# EAGLE design WaterMonitorV2.1 (EAGLE 7.4.0)
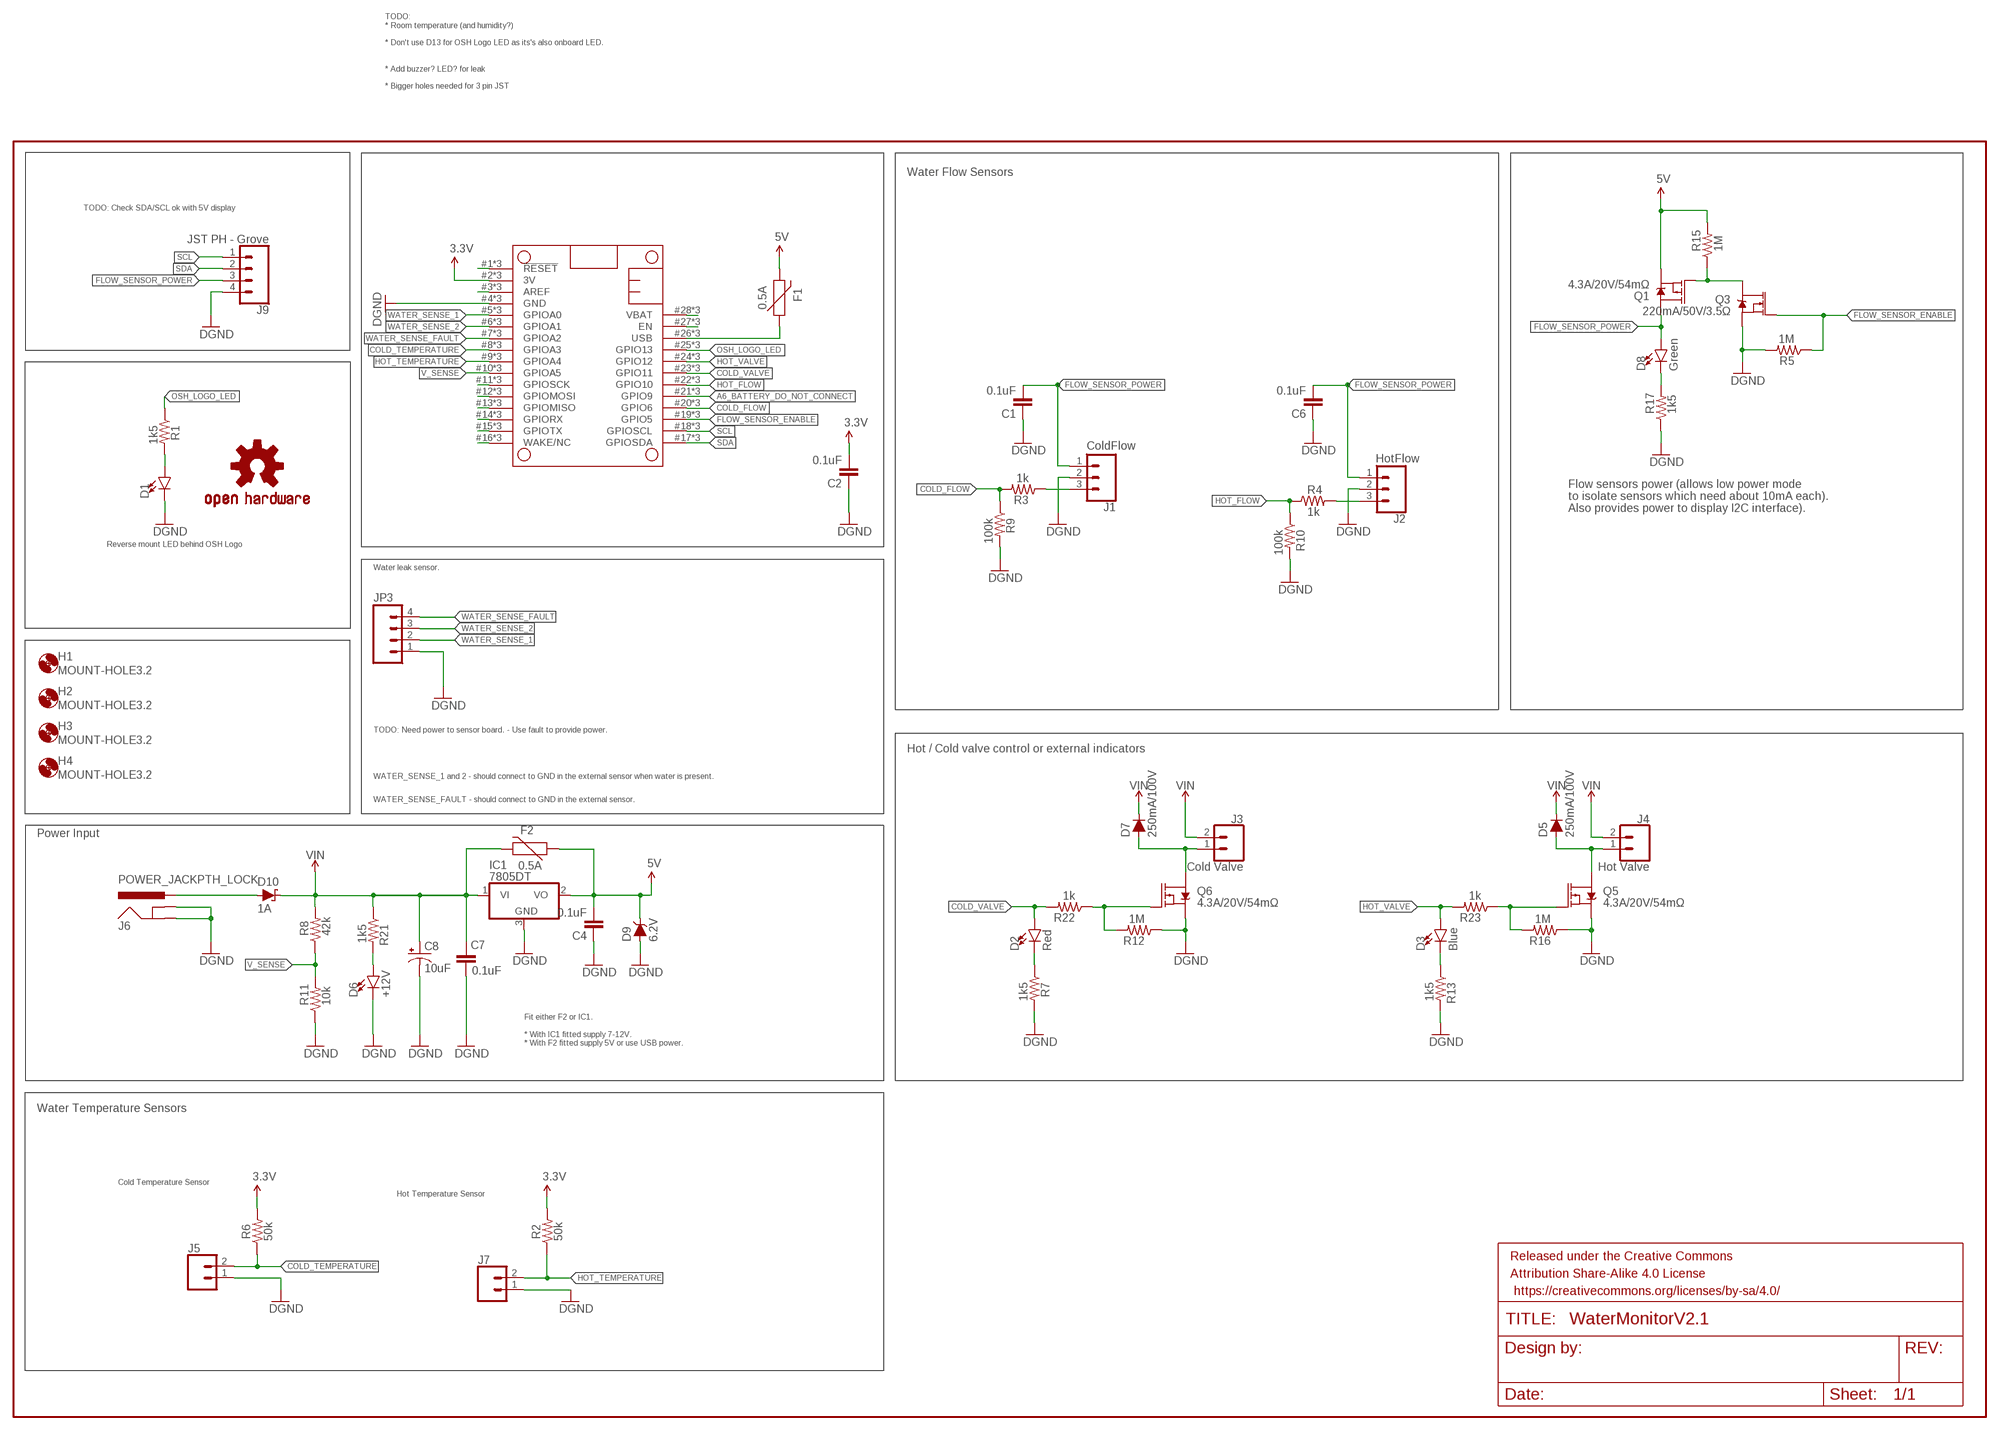
[diagram p0: schematic, sheet 1]

## Parts
C1  0.1uF  CAP0805  [0805]
C2  0.1uF  CAP0805  [0805]
C4  0.1uF  CAP0805  [0805]
C6  0.1uF  CAP0805  [0805]
C7  0.1uF  CAP0805  [0805]
C8  10uF  10UF-POLAR-EIA3216-16V-10%(TANT)  [EIA3216]
D1  LED1206-BOTTOM  [LED-1206-BOTTOM]
D2  Red  LED-BLUE1206  [LED-1206]
D3  Blue  LED-BLUE1206  [LED-1206]
D5  250mA/100V  DIODE-BAS16J  [SOD-323]
D6  +12V  LED-BLUE1206  [LED-1206]
D7  250mA/100V  DIODE-BAS16J  [SOD-323]
D8  Green  LED-BLUE1206  [LED-1206]
D9  6.2V  DIODE-ZENER-BZT52C3V6S  [SOD-323]
D10  1A  DIODE-SCHOTTKY-B340A  [SMA-DIODE]
F1  0.5A  PPTC_HALF-AMP  [1206]
F2  0.5A  PPTC_HALF-AMP  [1206]
FRAME2  FRAME-LEDGER  [CREATIVE_COMMONS]
H1  MOUNT-HOLE3.2  [3,2]
H2  MOUNT-HOLE3.2  [3,2]
H3  MOUNT-HOLE3.2  [3,2]
H4  MOUNT-HOLE3.2  [3,2]
IC1  7805DT  [TO252]
J1  ColdFlow  CONN_03JST-HX-PTH-VERT  [JST-HX-3-PTH-VERT]
J2  HotFlow  CONN_03JST-HX-PTH-VERT  [JST-HX-3-PTH-VERT]
J3  Cold Valve  CONN_025MM  [SCREWTERMINAL-5MM-2]
J4  Hot Valve  CONN_025MM  [SCREWTERMINAL-5MM-2]
J5  CONN_02POLAR  [MOLEX-1X2]
J6  POWER_JACKPTH_LOCK  [POWER_JACK_PTH_LOCK]
J7  CONN_02POLAR  [MOLEX-1X2]
J9  JST PH - Grove  CONN_04JST-PTH-VERT  [JST-4-PTH-VERT]
JP3  M04POLAR  [MOLEX-1X4@1]
LOGO1  OSHW-LOGOM  [OSHW-LOGO-M]
MS1  FEATHERWINGFEATHEWING_BREAKOUT  [FEATHERWING_BREAKOUT]
Q1  4.3A/20V/54mΩ  MOSFET_PCH-IRLML2244  [SOT23-3]
Q3  220mA/50V/3.5Ω  MOSFET-NCH-BSS138  [SOT23-3]
Q5  4.3A/20V/54mΩ  MOSFET_PCH-IRLML2244  [SOT23-3]
Q6  4.3A/20V/54mΩ  MOSFET_PCH-IRLML2244  [SOT23-3]
R1  1k5  RESISTOR0805  [0805]
R2  50k  RESISTOR0805  [0805]
R3  1k  RESISTOR0805  [0805]
R4  1k  RESISTOR0805  [0805]
R5  1M  RESISTOR0805  [0805]
R6  50k  RESISTOR0805  [0805]
R7  1k5  RESISTOR0805  [0805]
R8  42k  RESISTOR0805  [0805]
R9  100k  RESISTOR0805  [0805]
R10  100k  RESISTOR0805  [0805]
R11  10k  RESISTOR0805  [0805]
R12  1M  RESISTOR0805  [0805]
R13  1k5  RESISTOR0805  [0805]
R15  1M  RESISTOR0805  [0805]
R16  1M  RESISTOR0805  [0805]
R17  1k5  RESISTOR0805  [0805]
R21  1k5  RESISTOR0805  [0805]
R22  1k  RESISTOR0805  [0805]
R23  1k  RESISTOR0805  [0805]

## Nets
3.3V: C2.2 MS1.2(3V) MS1.#2(3V) MS1.@2(3V) R2.2 R6.2
5V: C4.2 D9.C F1.2 F2.1 IC1.2(VO) Q1.2(S) R15.2
A6_BATTERY_DO_NOT_CONNECT: MS1.21(GPIO9) MS1.#21(GPIO9) MS1.@21(GPIO9)
COLD_FLOW: MS1.20(GPIO6) MS1.#20(GPIO6) MS1.@20(GPIO6) R3.2 R9.1
COLD_TEMPERATURE: J5.2 MS1.8(GPIOA3) MS1.#8(GPIOA3) MS1.@8(GPIOA3) R6.1
COLD_VALVE: D2.A MS1.23(GPIO11) MS1.#23(GPIO11) MS1.@23(GPIO11) R22.2
FLOW_SENSOR_ENABLE: MS1.19(GPIO5) MS1.#19(GPIO5) MS1.@19(GPIO5) Q3.1(G) R5.1
FLOW_SENSOR_POWER: C1.2 C6.2 D8.A J1.1 J2.1 J9.3 Q1.3(D)
GND: C1.1 C2.1 C4.1 C6.1 C7.1 C8.- D1.C D6.C D9.A IC1.3(GND) J1.2 J2.2 J5.1 J6.GND J6.GNDBREAK J7.1 J9.4 JP3.1 MS1.4(GND) MS1.#4(GND) MS1.@4(GND) Q3.2(S) Q5.2(S) Q6.2(S) R5.2 R7.2 R9.2 R10.2 R11.1 R12.1 R13.2 R16.1 R17.1 ; supply symbol labelled DGND
HOT_FLOW: MS1.22(GPIO10) MS1.#22(GPIO10) MS1.@22(GPIO10) R4.1 R10.1
HOT_TEMPERATURE: J7.2 MS1.9(GPIOA4) MS1.#9(GPIOA4) MS1.@9(GPIOA4) R2.1
HOT_VALVE: D3.A MS1.24(GPIO12) MS1.#24(GPIO12) MS1.@24(GPIO12) R23.2
N$1: D2.C R7.1
N$3: J1.3 R3.1
N$4: J2.3 R4.2
N$6: D3.C R13.1
N$7: D8.C R17.2
N$11: D10.A J6.PWR
N$12: D6.A R21.2
N$13: MS1.1(!RESET) MS1.#1(!RESET) MS1.@1(!RESET)
N$15: MS1.27(EN) MS1.#27(EN) MS1.@27(EN)
N$19: Q1.1(G) Q3.3(D) R15.1
N$20: MS1.3(AREF) MS1.#3(AREF) MS1.@3(AREF)
N$21: D1.A R1.2
N$23: Q6.1(G) R12.2 R22.1
N$24: Q5.1(G) R16.2 R23.1
N$40: D7.A J3.1 Q6.3(D)
N$41: D5.A J4.1 Q5.3(D)
N$42: MS1.11(GPIOSCK) MS1.#11(GPIOSCK) MS1.@11(GPIOSCK)
N$43: MS1.12(GPIOMOSI) MS1.#12(GPIOMOSI) MS1.@12(GPIOMOSI)
N$44: MS1.13(GPIOMISO) MS1.#13(GPIOMISO) MS1.@13(GPIOMISO)
N$45: MS1.14(GPIORX) MS1.#14(GPIORX) MS1.@14(GPIORX)
N$46: MS1.15(GPIOTX) MS1.#15(GPIOTX) MS1.@15(GPIOTX)
N$47: MS1.16(WAKE/NC) MS1.#16(WAKE/NC) MS1.@16(WAKE/NC)
OSH_LOGO_LED: MS1.25(GPIO13) MS1.#25(GPIO13) MS1.@25(GPIO13) R1.1
SCL: J9.1 MS1.18(GPIOSCL) MS1.#18(GPIOSCL) MS1.@!8(GPIOSCL)
SDA: J9.2 MS1.17(GPIOSDA) MS1.#17(GPIOSDA) MS1.@17(GPIOSDA)
USB: F1.1 MS1.26(USB) MS1.#26(USB) MS1.@26(USB)
V_SENSE: MS1.10(GPIOA5) MS1.#10(GPIOA5) MS1.@10(GPIOA5) R8.1 R11.2
VBAT: MS1.28(VBAT) MS1.#28(VBAT) MS1.@28(VBAT)
VIN: C7.2 C8.+ D5.C D7.C D10.C F2.2 IC1.1(VI) J3.2 J4.2 R8.2 R21.1
WATER_SENSE_1: JP3.2 MS1.5(GPIOA0) MS1.#5(GPIOA0) MS1.@5(GPIOA0)
WATER_SENSE_2: JP3.3 MS1.6(GPIOA1) MS1.#6(GPIOA1) MS1.@6(GPIOA1)
WATER_SENSE_FAULT: JP3.4 MS1.7(GPIOA2) MS1.#7(GPIOA2) MS1.@7(GPIOA2)

## Notes on the sheet
- TODO: 
  * Room temperature (and humidity?)
  
  * Don't use D13 for OSH Logo LED as its's also onboard LED.
  
  
  * Add buzzer? LED? for leak
  
  * Bigger holes needed for 3 pin JST
- Water Flow Sensors
- TODO: Check SDA/SCL ok with 5V display
- Flow sensors power (allows low power mode 
  to isolate sensors which need about 10mA each).
  Also provides power to display I2C interface).
- Reverse mount LED behind OSH Logo
- Water leak sensor.
- TODO: Need power to sensor board. - Use fault to provide power.
- Hot / Cold valve control or external indicators
- WATER_SENSE_1 and 2 - should connect to GND in the external sensor when water is present.
- WATER_SENSE_FAULT - should connect to GND in the external sensor.
- Power Input
- Fit either F2 or IC1. 
  
  * With IC1 fitted supply 7-12V.
  * With F2 fitted supply 5V or use USB power.
- Water Temperature Sensors
- Cold Temperature Sensor
- Hot Temperature Sensor

## Library data of the parts
C1 C2 C4 C6 C7 = SparkFun-Passives:CAP: Capacitor Standard 0603 ceramic capacitor, and 0.1" leaded capacitor.
C8 = SparkFun-Capacitors:10UF-POLAR: 10.0µF polarized capacitors A capacitor is a passive two-terminal electrical component used to store electrical energy temporarily in an electric field.; PROD_ID: CAP-00811
D1 = SparkFun-LED:LED: LED (Generic) Standard schematic elements and footprints for 5mm, 3mm, 1206, and 0603 sized LEDs. Generic LEDs with no color specified.
D2 D3 D6 D8 = SparkFun-LED:LED-BLUE: Blue SMD LED Used in manufacturing of various products at SparkFun Packages: 0603 - SMD 0603 package [Product Link] <http://www.digikey.com/product-detail/en/SMLE12BC7TT86/511-1589-2-ND/1641808> 1206 - SMD1206 package [Product Link] <http://www.digikey.com/product-detail/en/lite-on-inc/LTST-C150TBKT/160-1643-1-ND/573584> SparkFun Products: ESP8266 Thing-Dev Board <https://www.sparkfun.com/products/13711> RedBoard <https://www.sparkfun.com/products/12757>; PROD_ID: DIO-09911; VALUE: BLUE
D5 D7 = SparkFun-DiscreteSemi:DIODE: Diode These are standard reverse protection diodes and small signal diodes. SparkFun Products: SparkFun SparkPunk Sound Kit <https://www.sparkfun.com/products/11177> SparkFun ESP8266 Thing <https://www.sparkfun.com/products/13231>; PROD_ID: DIO-09646
D9 = SparkFun-DiscreteSemi:DIODE-ZENER: Zener Diode A Zener diode allows current to flow from its anode to its cathode like a normal semiconductor diode, but it also permits current to flow in the reverse direction when its "Zener voltage" is reached. - WIkipedia; FARNELL: 1902438; MFG: BZT52C6V2; PROD_ID: DIO-08199; VALUE: 3.6V
D10 = SparkFun-DiscreteSemi:DIODE-SCHOTTKY: Schottky diode A Schottky diode is a semiconductor diode which has a low forward voltage drop and a very fast switching action.; PROD_ID: DIO-09886; VALUE: 3A/40V/500mV
F1 F2 = SparkFun-Fuses:PPTC: Resettable Fuse PPTC Resettable Fuse. Really a sort of resistor with a polymeric positive temperature coefficient whose resistance increases dramatically with an increase in temperature. When heated by the power passing through the resistance rises causing the current to be limited, protecting the circuit. This is achieved by the transition of the polymer from a crystalline to an amorphous state where the conductive carbon separates breaking the conductive pathways found in the cool crystalline structure. When a PPTC cools back down it resumes conducting letting the circuit turn back on. SparkFun Products: SparkFun RedBoard - Programmed with Arduino <https://www.sparkfun.com/products/12757> Pro Micro - 5V/16MHz <https://www.sparkfun.com/products/12640> Arduino Pro 328 - 5V/16MHz <https://www.sparkfun.com/products/10915> MP3 Trigger <https://www.sparkfun.com/products/13720>; PROD_ID: RES-08585; VALUE: 6V/0.5A
FRAME2 = SparkFun-Aesthetics:FRAME-LEDGER: Schematic Frame Standard 11x14 US Ledger frame
H1-H4 = holes:MOUNT-HOLE: MOUNTING HOLE with drill center marker
IC1 = linear:78*: Positive VOLTAGE REGULATOR Source: http://cache.national.com/ds/LM/LM78L05.pdf http://www.fairchildsemi.com/ds/LM/LM7805.pdf
J1 J2 = Tinamous:CONN_03: Multi connection point. Often used as Generic Header-pin footprint for 0.1 inch spaced/style header connections On any of the 0.1 inch spaced packages, you can populate with these: Break Away Headers - Straight <https://www.sparkfun.com/products/116> (PRT-00116) Break Away Male Headers - Right Angle <https://www.sparkfun.com/products/553> (PRT-00553) Female Headers <https://www.sparkfun.com/products/115> (PRT-00115) Break Away Headers - Machine Pin <https://www.sparkfun.com/products/117> (PRT-00117) Break Away Female Headers - Swiss Machine Pin <https://www.sparkfun.com/products/743> (PRT-00743) Stackable Header - 3 Pin (Female, 0.1") <https://www.sparkfun.com/products/13875> (PRT-13875) For SCREWTERMINALS and SPRING TERMINALS visit here: Screw Terimnals on SparkFun.com <https://www.sparkfun.com/search/results?term=Screw+Terminals> (5mm/3.5mm/2.54mm spacing) This device is also useful as a general connection point to wire up your design to another part of your project. Our various solder wires solder well into these plated through hole pads. Hook-Up Wire - Assortment (Stranded, 22 AWG) <https://www.sparkfun.com/products/11375> (PRT-11375) Hook-Up Wire - Assortment (Solid Core, 22 AWG) <https://www.sparkfun.com/products/11367> (PRT-11367) View the entire wire category on our website here <https://www.sparkfun.com/categories/141> Special notes: Molex polarized connector foot print use with SKU : PRT-08232 with associated crimp pins and housings.
J3 J4 = SparkFun-Connectors:CONN_02: Multi connection point. Often used as Generic Header-pin footprint for 0.1 inch spaced/style header connections On any of the 0.1 inch spaced packages, you can populate with these: Break Away Headers - Straight <https://www.sparkfun.com/products/116> (PRT-00116) Break Away Male Headers - Right Angle <https://www.sparkfun.com/products/553> (PRT-00553) Female Headers <https://www.sparkfun.com/products/115> (PRT-00115) Break Away Headers - Machine Pin <https://www.sparkfun.com/products/117> (PRT-00117) Break Away Female Headers - Swiss Machine Pin <https://www.sparkfun.com/products/743> (PRT-00743) For SCREWTERMINALS and SPRING TERMINALS visit here: Screw Terimnals on SparkFun.com <https://www.sparkfun.com/search/results?term=Screw+Terminals> (5mm/3.5mm/2.54mm spacing) This device is also useful as a general connection point to wire up your design to another part of your project. Our various solder wires solder well into these plated through hole pads. Hook-Up Wire - Assortment (Stranded, 22 AWG) <https://www.sparkfun.com/products/11375> (PRT-11375) Hook-Up Wire - Assortment (Solid Core, 22 AWG) <https://www.sparkfun.com/products/11367> (PRT-11367) View the entire wire category on our website here <https://www.sparkfun.com/categories/141> Special notes: Molex polarized connector foot print use with: PRT-08233 with associated crimp pins and housings. 2.54_SCREWTERM for use with PRT-10571. 3.5mm Screw Terminal footprints for PRT-08084 5mm Screw Terminal footprints for use with PRT-08432; SF_SKU: PRT-08432
J5 J7 = SparkFun-Connectors:CONN_02: Multi connection point. Often used as Generic Header-pin footprint for 0.1 inch spaced/style header connections On any of the 0.1 inch spaced packages, you can populate with these: Break Away Headers - Straight <https://www.sparkfun.com/products/116> (PRT-00116) Break Away Male Headers - Right Angle <https://www.sparkfun.com/products/553> (PRT-00553) Female Headers <https://www.sparkfun.com/products/115> (PRT-00115) Break Away Headers - Machine Pin <https://www.sparkfun.com/products/117> (PRT-00117) Break Away Female Headers - Swiss Machine Pin <https://www.sparkfun.com/products/743> (PRT-00743) For SCREWTERMINALS and SPRING TERMINALS visit here: Screw Terimnals on SparkFun.com <https://www.sparkfun.com/search/results?term=Screw+Terminals> (5mm/3.5mm/2.54mm spacing) This device is also useful as a general connection point to wire up your design to another part of your project. Our various solder wires solder well into these plated through hole pads. Hook-Up Wire - Assortment (Stranded, 22 AWG) <https://www.sparkfun.com/products/11375> (PRT-11375) Hook-Up Wire - Assortment (Solid Core, 22 AWG) <https://www.sparkfun.com/products/11367> (PRT-11367) View the entire wire category on our website here <https://www.sparkfun.com/categories/141> Special notes: Molex polarized connector foot print use with: PRT-08233 with associated crimp pins and housings. 2.54_SCREWTERM for use with PRT-10571. 3.5mm Screw Terminal footprints for PRT-08084 5mm Screw Terminal footprints for use with PRT-08432; SF_ID: PRT-09918
J6 = SparkFun-Connectors:POWER_JACK: Power Jack Connector This is the standard 5.5mm barrel jack for power. The PTH is the most common, proven, reliable, footprint. The Slot footprint only works if the mill layer is transmitted to the PCB fab house so be warned. Here are the connectors we sell at SparkFun: DC Barrel Power Jack/Connector <https://www.sparkfun.com/products/119> (PRT-00119) DC Barrel Power Jack/Connector (SMD) <https://www.sparkfun.com/products/12748> (PRT-12748) DC Barrel Jack Adapter - Breadboard Compatible <https://www.sparkfun.com/products/10811> (PRT-10811) It is used on this SparkFun product (and many, many others): SparkFun RedBoard - Programmed with Arduino <https://www.sparkfun.com/products/12757> (DEV-12757) Also, if you need a mating power supply or connector, please check these out: Wall Adapter Power Supply - 9VDC 650mA <https://www.sparkfun.com/products/298> (TOL-00298) DC Barrel Jack Adapter - Male <https://www.sparkfun.com/products/10287> (PRT-10287); PROD_ID: CONN-08197; SF_ID: PRT-00119
J9 = SparkFun-Connectors:CONN_04: Multi connection point. Often used as Generic Header-pin footprint for 0.1 inch spaced/style header connections On any of the 0.1 inch spaced packages, you can populate with these: Break Away Headers - Straight <https://www.sparkfun.com/products/116> (PRT-00116) Break Away Male Headers - Right Angle <https://www.sparkfun.com/products/553> (PRT-00553) Female Headers <https://www.sparkfun.com/products/115> (PRT-00115) Break Away Headers - Machine Pin <https://www.sparkfun.com/products/117> (PRT-00117) Break Away Female Headers - Swiss Machine Pin <https://www.sparkfun.com/products/743> (PRT-00743) For SCREWTERMINALS and SPRING TERMINALS visit here: Screw Terimnals on SparkFun.com <https://www.sparkfun.com/search/results?term=Screw+Terminals> (5mm/3.5mm/2.54mm spacing) This device is also useful as a general connection point to wire up your design to another part of your project. Our various solder wires solder well into these plated through hole pads. Hook-Up Wire - Assortment (Stranded, 22 AWG) <https://www.sparkfun.com/products/11375> (PRT-11375) Hook-Up Wire - Assortment (Solid Core, 22 AWG) <https://www.sparkfun.com/products/11367> (PRT-11367) View the entire wire category on our website here <https://www.sparkfun.com/categories/141> Special notes: Molex polarized connector foot print use with SKU : PRT-08231 with associated crimp pins and housings. 1MM SMD Version SKU: PRT-10208; PROD_ID: CONN-13251
JP3 = SparkFun-Connectors:M04: Header 4 Standard 4-pin 0.1" header. Use with straight break away headers (SKU : PRT-00116), right angle break away headers (PRT-00553), swiss pins (PRT-00743), machine pins (PRT-00117), and female headers (PRT-00115). Molex polarized connector foot print use with SKU : PRT-08231 with associated crimp pins and housings. 1MM SMD Version SKU: PRT-10208
LOGO1 = SparkFun-Aesthetics:OSHW-LOGO: Open Source Hardware Logo This logo indicates the piece of hardware it is found on incorporates a OSHW license and/or adheres to the definition of open source hardware found here: http://freedomdefined.org/OSHW
MS1 = ThingySticks:FEATHERWING
Q1 Q5 Q6 = SparkFun-DiscreteSemi:MOSFET_PCH: P-channel MOSFETs Voltage controlled devices that allow control of high current outputs. SparkFun Products: SparkFun ESP32 Thing <https://www.sparkfun.com/products/13907> SparkFun ESP8266 Thing <https://www.sparkfun.com/products/13231>; PROD_ID: TRANS-11153
Q3 = SparkFun-DiscreteSemi:MOSFET-NCH: N-channel MOSFETs Voltage controlled devices that allow control of high current outputs. SparkFun Products: SparkFun OpenScale <https://www.sparkfun.com/products/13261> SparkFun Digital Sandbox <https://www.sparkfun.com/products/12651> SparkFun Monster Moto Shield <https://www.sparkfun.com/products/10182> SparkFun MOSFET Power Controller <https://www.sparkfun.com/products/11214>; PROD_ID: TRANS-00830
R1-R13 R15-R17 R21-R23 = SparkFun-Resistors:RESISTOR: Generic Resistor Package

## Board
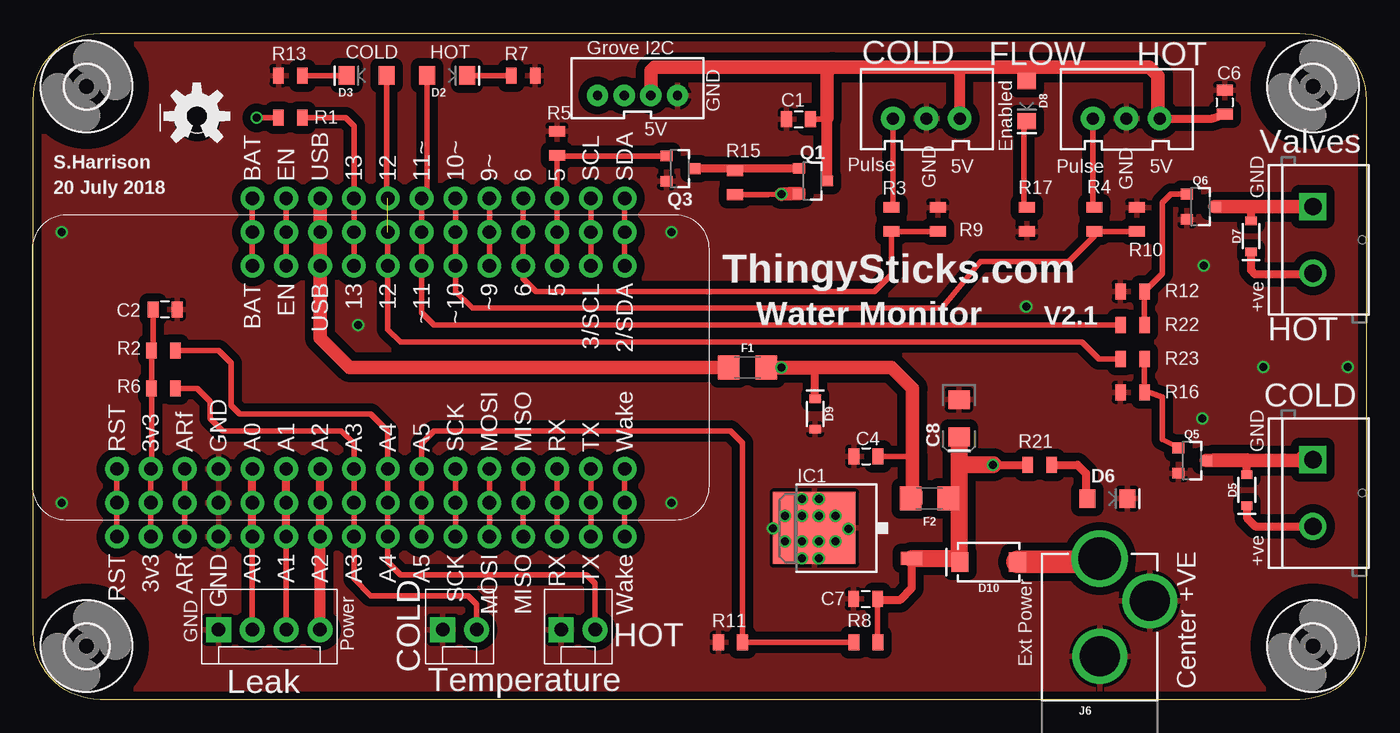
[diagram p1: board, top side]
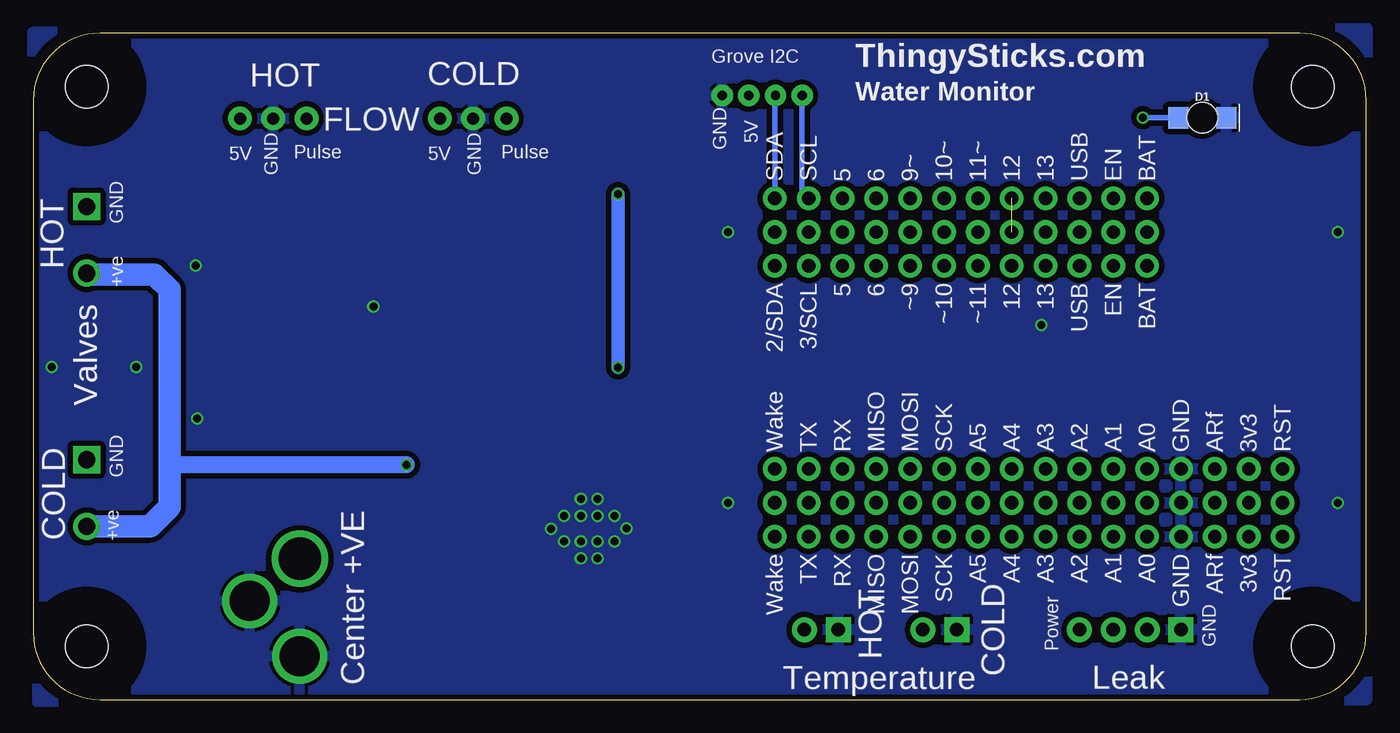
[diagram p2: board, bottom side, seen from below]

Size 100 x 50 mm. Coordinates in mm from the lower left corner, seen from the top.
Outline: 5,50 95,50 arc-90 100,45 100,5 arc-90 95,0 5,0 arc-90 0,5 0,45 arc-90 5,50
Copper layers (1*16): Top 0.035mm / dielectric 1.5mm / Bottom 0.035mm
Design rules "dirt_cheap_dirty_boards.v1": minimum track width 5mil, minimum drill 12mil, track to track 5mil, track to pad 5mil, pad to pad 5mil, via to via 5mil, smd to smd 0mil, copper to edge 10mil, drill to drill 10mil, minimum pad ring 10mil, minimum via ring 6mil, stop-mask expansion 2mil, vias tented up to drill 25mil, thermal gap 10mil

### Footprints (pad centres in the part's own frame; a part is rotated, then mirrored left to right if it is on the bottom)
0805 = smd 0.8 x 1.2: 1 -0.9,0; 2 0.9,0
EIA3216 = smd 1.4 x 1.6: + 1.4,0; - -1.4,0
LED-1206-BOTTOM = smd 1.5 x 1.6: A -1.8,0; C 1.8,0 | hole 2.3: 0,0
LED-1206 = smd 1.2 x 1.4: A -1.5,0; C 1.5,0
SOD-323 = smd 0.63 x 0.83: A 1.15,0; C -1.15,0
SMA-DIODE = smd 1.27 x 1.47: A -2.15,0; C 2.15,0
1206 = smd 1.6 x 1.8: 1 -1.4,0; 2 1.4,0
3,2 = hole 3.2: 0,0
TO252 = smd 1 x 1.6: 1 -2.28,-4.8; 2 2.28,-4.8 | smd 5.4 x 6.2: 3 0,2.5
JST-HX-3-PTH-VERT = drill 0.9 pad 1.778: 1 7.5,2.35; 2 5,2.35; 3 2.5,2.35
SCREWTERMINAL-5MM-2 = drill 1.3 pad 2.032 square: 1 0,0 | drill 1.3 pad 2.032: 2 5,0
MOLEX-1X2 = drill 1.016 pad 1.88 square: 1 0,0 | drill 1.016 pad 1.88: 2 2.54,0
POWER_JACK_PTH_LOCK = drill 2.997 pad 4.115: GND 0.025,6.557; GNDBREAK 3.762,10.7 | drill 3.2 pad 4.115: PWR 0,13.878
JST-4-PTH-VERT = drill 0.7 pad 1.6: 1 -3,-0.55; 2 -1,-0.55; 3 1,-0.55; 4 3,-0.55
MOLEX-1X4@1 = drill 1.016 pad 1.88 square: 1 0,0 | drill 1.016 pad 1.88: 2 2.54,0; 3 5.08,0; 4 7.62,0
FEATHERWING_BREAKOUT = drill 1 pad 1.778: 1 6.35,1.27; 2 8.89,1.27; 3 11.43,1.27; 4 13.97,1.27; 5 16.51,1.27; 6 19.05,1.27; 7 21.59,1.27; 8 24.13,1.27; 9 26.67,1.27; 10 29.21,1.27; 11 31.75,1.27; 12 34.29,1.27; 13 36.83,1.27; 14 39.37,1.27; 15 41.91,1.27; 16 44.45,1.27; 17 44.45,21.59; 18 41.91,21.59; 19 39.37,21.59; 20 36.83,21.59; 21 34.29,21.59; 22 31.75,21.59; 23 29.21,21.59; 24 26.67,21.59; 25 24.13,21.59; 26 21.59,21.59; 27 19.05,21.59; 28 16.51,21.59; #1 6.35,3.81; #2 8.89,3.81; #3 11.43,3.81; #4 13.97,3.81; #5 16.51,3.81; #6 19.05,3.81; #7 21.59,3.81; #8 24.13,3.81; #9 26.67,3.81; #10 29.21,3.81; #11 31.75,3.81; #12 34.29,3.81; #13 36.83,3.81; #14 39.37,3.81; #15 41.91,3.81; #16 44.45,3.81; #17 44.45,19.05; #18 41.91,19.05; #19 39.37,19.05; #20 36.83,19.05; #21 34.29,19.05; #22 31.75,19.05; #23 29.21,19.05; #24 26.67,19.05; #25 24.13,19.05; #26 21.59,19.05; #27 19.05,19.05; #28 16.51,19.05; @1 6.35,-1.27; @2 8.89,-1.27; @3 11.43,-1.27; @4 13.97,-1.27; @5 16.51,-1.27; @6 19.05,-1.27; @7 21.59,-1.27; @8 24.13,-1.27; @9 26.67,-1.27; @10 29.21,-1.27; @11 31.75,-1.27; @12 34.29,-1.27; @13 36.83,-1.27; @14 39.37,-1.27; @15 41.91,-1.27; @16 44.45,-1.27; @17 44.45,24.13; @19 39.37,24.13; @20 36.83,24.13; @21 34.29,24.13; @22 31.75,24.13; @23 29.21,24.13; @24 26.67,24.13; @25 24.13,24.13; @26 21.59,24.13; @27 19.05,24.13; @28 16.51,24.13; @!8 41.91,24.13
SOT23-3 = smd 0.8 x 0.9: 1 -0.95,-1; 2 0.95,-1; 3 0,1.1

### Placement (x,y rotation side)
C1  57.41,43.55 0 top
C2  9.89,29.27 180 top
C4  62.47,18.26 0 top
C6  89.39,44.83 270 top
C7  62.44,7.55 0 top
C8  69.45,21.11 270 top
D1  12.3,43.66 0 bottom
D2  31.04,46.83 0 top
D3  25.01,46.83 180 top
D5  91.05,15.71 90 top
D6  80.57,15.08 0 top
D7  91.36,34.77 90 top
D8  74.53,44.92 270 top
D9  58.66,21.43 270 top
D10  71.68,10.32 180 top
F1  53.58,24.92 0 top
F2  67.23,15.08 0 top
FRAME2  16.75,-12.23 0 top  (outside the outline)
H1  4,46 0 top
H2  96,4 0 top
H3  96,46 0 top
H4  4,4 0 top
IC1  61.09,12.87 90 top
J1  62,41.25 0 top
J2  77,41.25 0 top
J3  96,37 270 top
J4  96,18 270 top
J5  30.72,5.24 0 top
J6  80,-3.31 0 top
J7  39.61,5.24 0 top
J9  45.33,45.88 0 top
JP3  13.89,5.24 0 top
LOGO1  12.27,43.78 0 top
MS1  -0.08,13.49 0 top
Q1  58.44,38.91 270 top
Q3  48.5,39.84 270 top
Q5  86.92,17.94 270 top
Q6  87.55,36.99 270 top
R1  19.29,43.66 180 top
R2  9.77,26.19 180 top
R3  64.38,36.03 270 top
R4  79.61,36.03 90 top
R5  39.29,41.75 90 top
R6  9.77,23.34 180 top
R7  36.75,46.83 0 top
R8  62.47,4.29 0 top
R9  67.87,36.03 90 top
R10  82.79,36.03 90 top
R11  52.31,4.29 0 top
R12  82.47,30.64 0 top
R13  19.29,46.83 180 top
R15  52.65,38.79 270 top
R16  82.47,23.05 0 top
R17  74.53,36.03 90 top
R21  75.49,17.62 0 top
R22  82.47,28.1 180 top
R23  82.47,25.56 180 top

### Tracks (layer width: path | path; a pad name or v marks a point on that pad's centre or on a via)
3.3V
  Top 0.406: MS1.@2 MS1.2 MS1.#2 8.86,17.36 R6.2 R2.2 8.99,26.32 C2.2
5V  (via drill 0.6)
  Top 0.406: R15.2 55.12,37.89 v56.12,37.94 | C4.2 65.96,18.26
  Top 0.61: D9.C 58.66,24.89
  Top 1.016: Q1.2 56.78,37.96 v56.12,37.94 | 58.66,24.89 54.98,24.89 F1.2 v56.12,24.92 64.38,24.92 65.96,23.34 65.96,18.26 65.96,15.22 IC1.2
  Top 1.27: F2.1 65.96,15.08 IC1.2
  Bottom 1.016: v56.12,24.92 v56.12,37.94
A6_BATTERY_DO_NOT_CONNECT
  Top 0.406: MS1.@21 MS1.21 MS1.#21
COLD_FLOW
  Top 0.406: MS1.@20 MS1.20 MS1.#20 36.75,31.59 37.7,30.64 63.11,30.64 64.38,31.91 R3.2 R9.1
COLD_TEMPERATURE
  Top 0.406: J5.2 33.26,7.14 32.62,7.78 25.32,7.78 24.05,9.05 MS1.@8 MS1.8 MS1.#8 24.05,19.21 23.1,20.16 14.21,20.16 13.26,21.11 13.26,22.38 12.3,23.34 R6.1 10.72,23.28
COLD_VALVE
  Top 0.406: R22.2 30.09,28.1 29.13,29.05 MS1.#23 MS1.23 MS1.@23 29.54,38.03 D2.A
FLOW_SENSOR_ENABLE
  Top 0.406: MS1.#19 MS1.19 MS1.@19 R5.1 39.34,40.8 46.86,40.8 Q3.1
FLOW_SENSOR_POWER
  Top 0.406: D8.A 74.53,47.47 | C1.2 59.44,43.55 59.54,43.66
  Top 0.61: J2.1 88.44,43.6 C6.2
  Top 0.813: J1.1 69.5,46.78 69.45,47.47 | Q1.3 59.54,43.66
  Top 1.016: J2.1 84.38,44.36 84.38,46.83 83.74,47.47 74.53,47.47 69.45,47.47 59.93,47.47 | J9.3 46.33,47.2 46.59,47.47 59.93,47.47 | 59.54,43.66 59.54,47.08 59.93,47.47
GND  (via drill 0.6)
  other vias: 24.37,28.1 60.19,11.87 60.19,13.77 58.92,15.04 57.66,15.04 56.39,13.77 57.66,13.77 58.92,13.77 58.92,11.87 57.66,11.87 56.39,11.87 57.66,10.6 58.92,10.6 55.48,12.86 61.15,12.82 47.87,14.76 74.49,29.51 87.82,32.57 87.72,21.09 2.14,14.76 47.87,35.08 92.27,24.95 98.62,24.95 2.14,35.08
  pour Bottom (isolate 0.406, rank 6): -0.11,50.37 100.07,50.07 99.69,-0.18 8.57,-0.08 -0.06,0
  pour Top (isolate 0.61, rank 6): -0.1,50.41 100.05,50.08 99.83,-0.13 0.01,-0.41
HOT_FLOW
  Top 0.406: MS1.@22 MS1.22 MS1.#22 31.67,30.64 32.94,29.37 68.19,29.37 71.04,32.86 77.71,32.86 79.61,34.77 R4.1 R10.1
HOT_TEMPERATURE
  Top 0.406: J7.2 42.15,8.73 41.52,9.37 27.55,9.37 26.59,10.32 MS1.@9 MS1.9 MS1.#9 26.59,20.16 25.32,21.43 15.48,21.43 14.84,22.06 14.84,25.24 13.89,26.19 R2.1
HOT_VALVE  (1 unrouted)
  Top 0.406: MS1.24 MS1.#24 26.59,27.78 27.55,26.83 78.66,26.83 79.93,25.56 R23.2 | D3.A 26.51,37.71 MS1.@24
N$1
  Top 0.406: R7.1 D2.C
N$3
  Top 0.406: J1.3 64.5,37.06 R3.1
N$4
  Top 0.406: J2.3 79.5,37.05 R4.2
N$6
  Top 0.406: R13.1 D3.C
N$7
  Top 0.406: R17.2 74.32,37.03 74.32,43.21 D8.C
N$11
  Top 1.676: D10.A 79.75,10.32 J6.PWR
N$12
  Top 0.61: R21.2 78.34,17.62 78.98,16.98 78.98,15.17 D6.A
N$13
  Top 0.406: MS1.#1 MS1.1 MS1.@1
N$15
  Top 0.406: MS1.#27 MS1.27 MS1.@27
N$19
  Top 0.61: Q1.1 52.63,39.86 | 52.63,39.86 50.53,39.86 Q3.3 | R15.1 52.65,39.84 52.63,39.86
N$20
  Top 0.406: MS1.#3 MS1.3 MS1.@3
N$21  (via drill 0.6)
  Top 0.406: v16.75,43.66 R1.2
  Bottom 0.406: D1.A v16.75,43.66
N$23
  Top 0.406: R22.1 R12.2 84.69,31.96 84.69,37.3 85.33,37.94 Q6.1
N$24
  Top 0.406: R23.1 R16.2 83.71,23.05 84.69,22.7 84.69,19.52 85.97,18.89 Q5.1
N$40
  Top 0.61: D7.A 91.36,36.67 91.68,36.99
  Top 1.016: J3.1 95.99,36.99 91.68,36.99 Q6.3
N$41
  Top 0.406: 96.23,18.23 J4.1
  Top 0.61: D5.A 91.05,18
  Top 1.016: Q5.3 88.5,17.94 | 88.5,17.94 95.43,17.94 95.49,18 | 91.05,18 88.57,18 88.5,17.94
  Top 1.676: J4.1 95.49,18
N$42
  Top 0.406: MS1.@11 MS1.11 MS1.#11
N$43
  Top 0.406: MS1.#12 MS1.12 MS1.@12
N$44
  Top 0.406: MS1.@13 MS1.13 MS1.#13
N$45
  Top 0.406: MS1.#14 MS1.14 MS1.@14
N$46
  Top 0.406: MS1.@15 MS1.15 MS1.#15
N$47
  Top 0.406: MS1.#16 MS1.16 MS1.@16
OSH_LOGO_LED
  Top 0.406: MS1.#25 MS1.25 MS1.@25 24.05,43.02 23.42,43.66 R1.1
SCL
  Top 0.406: MS1.@!8 MS1.18 MS1.#18
  Bottom 0.406: J9.1 42.33,38.11 MS1.@!8
SDA
  Top 0.406: MS1.#17 MS1.17 MS1.@17
  Bottom 0.406: MS1.@17 44.37,45.28 J9.2
USB
  Top 1.016: F1.1 23.73,24.92 21.51,27.14 MS1.#26 MS1.26 MS1.@26
V_SENSE
  Top 0.406: R8.1 R11.2 53.21,19.26 52.31,20.16 30.09,20.16 29.13,19.21 MS1.#10 MS1.10 MS1.@10
VBAT
  Top 0.406: MS1.@28 MS1.28 MS1.#28
VIN  (via drill 0.6)
  Top 0.406: C7.2 63.34,4.32 R8.2
  Top 0.61: IC1.1 65.89,8.35 65.01,7.46 63.44,7.46 C7.2 | D5.C 91.05,13.63 91.68,13 J4.2 | J3.2 96.12,32.12 96.12,32.23 95.81,31.91 91.68,31.91 91.36,32.23 D7.C | v72,17.62 R21.1
  Top 1.016: F2.2 69.45,15.08
  Top 1.27: C8.+ 69.45,17.62 | 69.45,17.62 69.45,15.08 69.45,10.39 D10.C 69.25,10.59 IC1.1 | v72,17.62 69.45,17.62
  Bottom 1.27: v72,17.62 89.78,17.62
  Bottom 1.676: J4.2 91.22,13 89.78,14.45 89.78,17.62 89.78,30.76 90.92,31.91 95.91,31.91 J3.2
WATER_SENSE_1
  Top 0.406: JP3.2 MS1.@5
  Top 0.61: MS1.@5 MS1.5 MS1.#5
WATER_SENSE_2
  Top 0.406: JP3.3 MS1.@6
  Top 0.61: MS1.@6 MS1.6 MS1.#6
WATER_SENSE_FAULT
  Top 0.61: MS1.@7 MS1.7 MS1.#7
  Top 0.813: JP3.4 MS1.@7

### Text on the board
tNames: COLD | HOT | Grove I2C | COLD | FLOW | HOT | GND | 5V | Valves | Enabled | S.Harrison | Pulse | 5V | Pulse | 5V | 20 July 2018 | GND | GND | GND | ThingySticks.com | +ve | Water Monitor | V2.1 | HOT | COLD | GND | +ve | Ext Power | HOT | GND | Power | COLD | Temperature | Center +VE | Leak
bNames: Grove I2C | ThingySticks.com | COLD | HOT | Water Monitor | FLOW | 5V | GND | Pulse | Pulse | 5V | 5V | GND | GND | HOT | GND | +ve | Valves | COLD | GND | +ve | COLD | GND | Power | Temperature | HOT | Leak | Center +VE